# EasyEDA Pro project zkxh_robot_race_FOC_2025.eprj, board PCB1
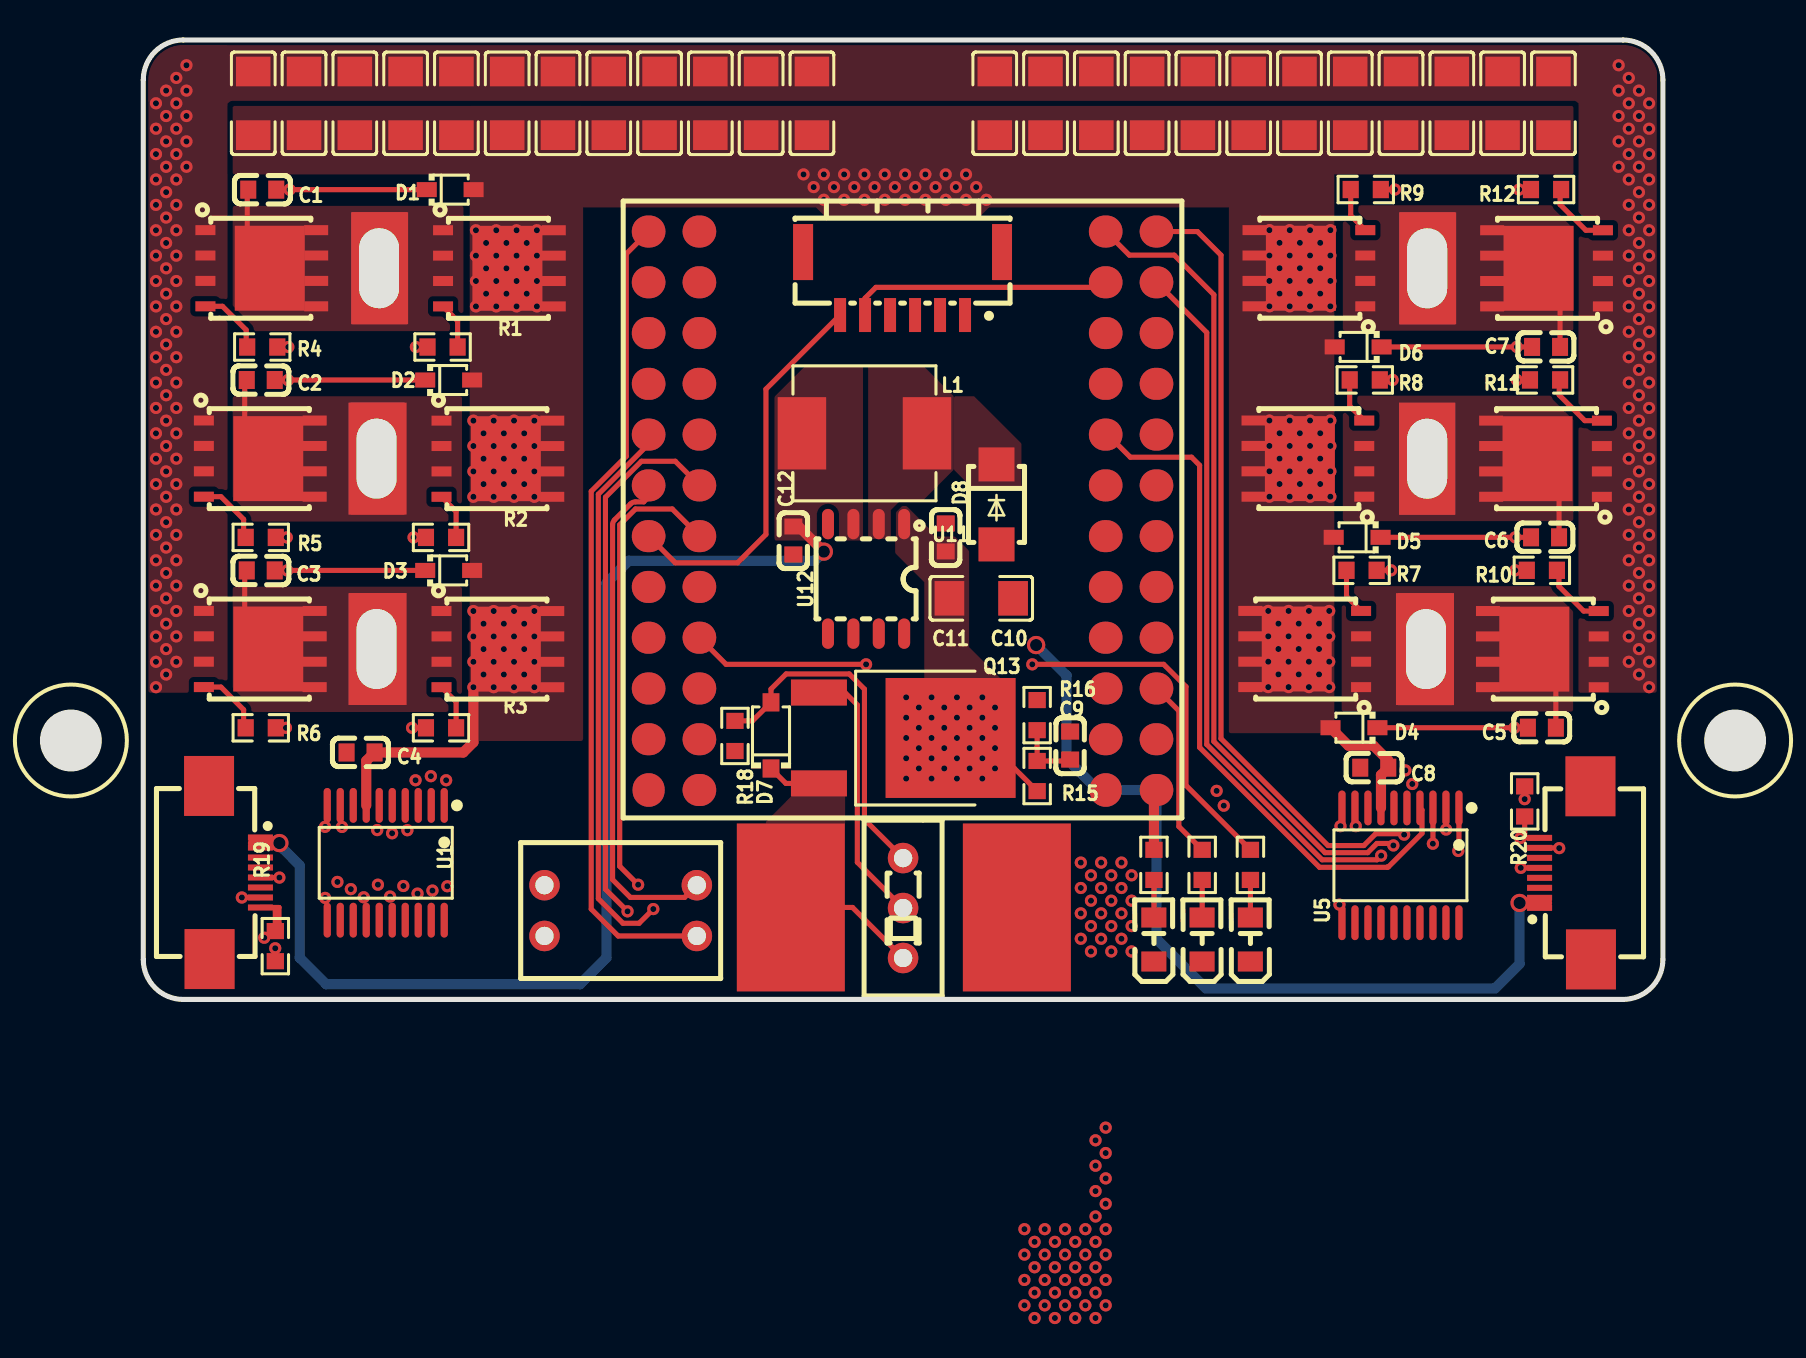
[diagram p2: board, top side]
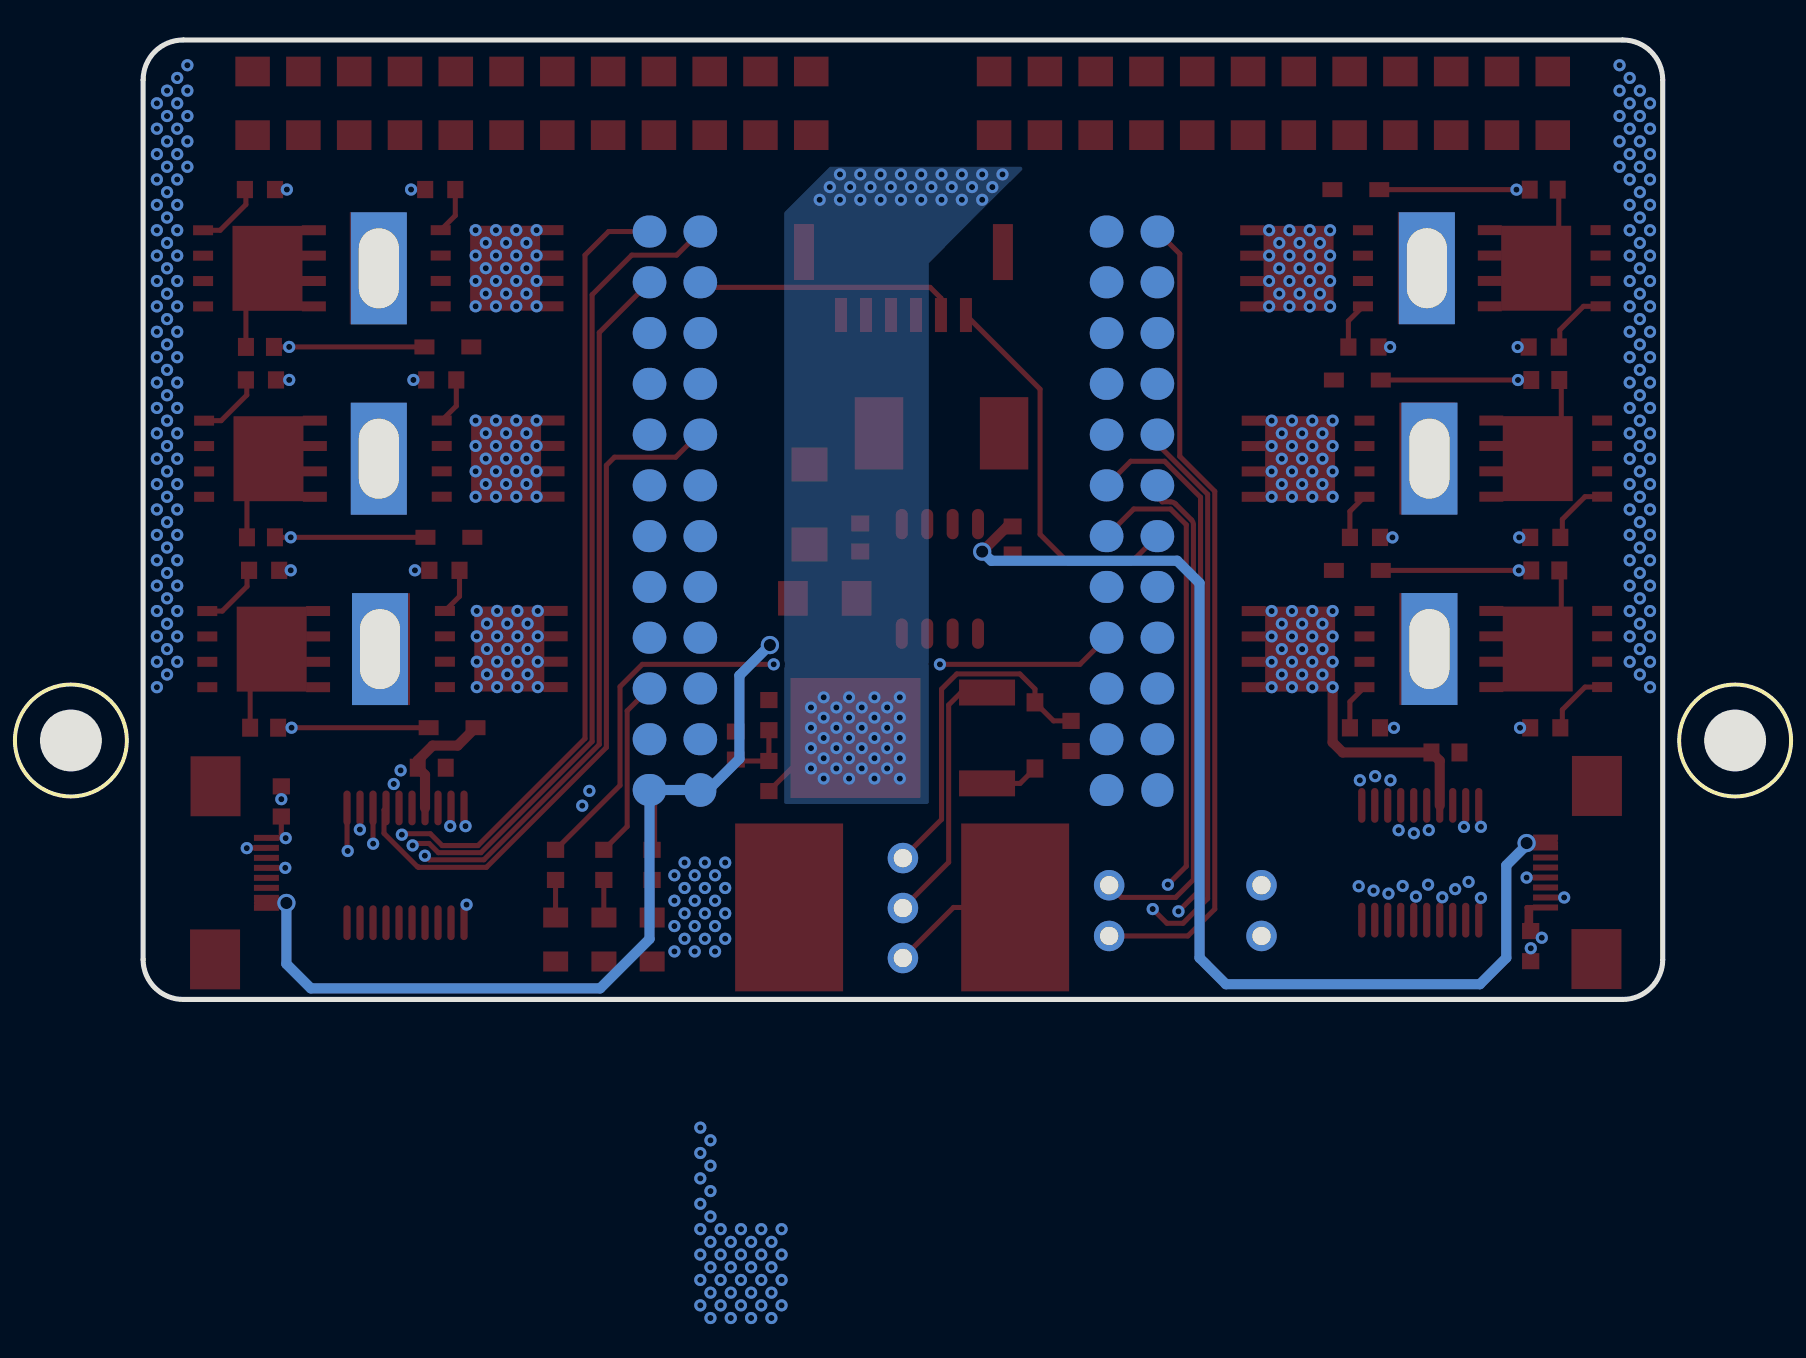
[diagram p3: board, bottom side, seen from below]

Outline 86.32 x 48 mm; copper layers: Top Layer, Inner1, Inner2, Bottom Layer. Coordinates in mm from the lower left corner of the outline.
Outline path: 5.17,46 5.17,2 arc(5.75,0.59) 7.17,0 79.17,0 arc(80.58,0.59) 81.17,2 81.17,46 arc(80.58,47.41) 79.17,48 7.17,48 arc(5.75,47.41) 5.17,46
Stack: Top Layer 0.035mm 外层铜厚1oz / Dielectric1 0.2104mm 7628 RC49% 8.6mil / Inner1 0.0152mm 内层铜厚 / Dielectric2 1.065mm 1.1mm H/HOZ Copper / Inner2 0.0152mm 内层铜厚 / Dielectric3 0.2104mm 7628 RC49% 8.6mil / Bottom Layer 0.035mm 外层铜厚1oz

## Design rules (mm)
template: 自定义配置1
spacing copperThickness1oz (default): track to track 0.102, other pairs 0.152 to 0.3
spacing copperThickness2oz: track to track 0.203, other pairs 0.152 to 0.3
track width copperThickness1oz (default): min 0.127, default 0.254, max 2.54
track width copperThickness2oz: min 0.203, default 0.508, max 2.54
differential pair differentialPair (default): width min 0.127, default 0.254, max 2.54; gap min 0.152, default 0.152
via viaSize (default): diameter min 0.5, default 0.61, max 10; hole min 0.3, default 0.305, max 6.299
net GND uses copperRegionAll
net VCC5V uses copperRegionAll, copperThickness2oz
net L_VS1 uses copperRegionAll
net L_VS2 uses copperRegionAll
net L_VS3 uses copperRegionAll
net R_VS1 uses copperRegionAll
net R_VS2 uses copperRegionAll
net R_VS3 uses copperRegionAll
net VCCBAT uses copperRegionAll, copperThickness2oz
net $1N6323 uses copperRegionAll
net $1N6897 uses copperRegionAll

## Placement (name value [footprint] x y rotation side)
C1  100nF  [C0603]  11.12 40.51 180 top
C2  100nF  [C0603]  11.04 30.99 180 top
C3  100nF  [C0603]  11.04 21.46 180 top
C4  22uF  [C0603]  16.03 12.36 0 top
C5  100nF  [C0603]  75.11 13.59 0 top
C6  100nF  [C0603]  75.27 23.12 0 top
C7  100nF  [C0603]  75.32 32.64 0 top
C8  22uF  [C0603]  66.73 11.59 0 top
C9  100nF  [C0603]  51.52 12.7 90 top
C10  10uF  [C1206]  47.08 20.07 0 top
C11  1uF  [C0603]  45.3 23.11 90 top
C12  22uF  [C0603]  37.68 22.96 90 top
C13  22uF  [C1206]  50.29 44.83 270 top
C14  22uF  [C1206]  47.75 44.83 270 top
C15  22uF  [C1206]  38.61 44.83 270 top
C16  22uF  [C1206]  36.07 44.83 270 top
C17  22uF  [C1206]  33.53 44.83 270 top
C18  22uF  [C1206]  30.99 44.83 270 top
C19  22uF  [C1206]  28.45 44.83 270 top
C20  22uF  [C1206]  25.91 44.83 270 top
C21  22uF  [C1206]  23.37 44.83 270 top
C22  22uF  [C1206]  20.83 44.83 270 top
C23  22uF  [C1206]  18.29 44.83 270 top
C24  22uF  [C1206]  15.75 44.83 270 top
C25  22uF  [C1206]  13.21 44.83 270 top
C26  22uF  [C1206]  10.67 44.83 270 top
C27  22uF  [C1206]  75.69 44.83 270 top
C28  22uF  [C1206]  73.15 44.83 270 top
C29  22uF  [C1206]  70.61 44.83 270 top
C30  22uF  [C1206]  68.07 44.83 270 top
C31  22uF  [C1206]  65.53 44.83 270 top
C32  22uF  [C1206]  62.99 44.83 270 top
C33  22uF  [C1206]  60.45 44.83 270 top
C34  22uF  [C1206]  57.91 44.83 270 top
C35  22uF  [C1206]  55.37 44.83 270 top
C36  22uF  [C1206]  52.83 44.83 270 top
D1  1N5819WS  [SOD-323_L1.8-W1.3-LS2.5-RD]  20.52 40.51 0 top
D2  1N5819WS  [SOD-323_L1.8-W1.3-LS2.5-RD]  20.44 30.99 0 top
D3  1N5819WS  [SOD-323_L1.8-W1.3-LS2.5-RD]  20.44 21.46 0 top
D4  1N5819WS  [SOD-323_L1.8-W1.3-LS2.5-RD]  65.72 13.59 180 top
D5  1N5819WS  [SOD-323_L1.8-W1.3-LS2.5-RD]  65.87 23.12 180 top
D6  1N5819WS  [SOD-323_L1.8-W1.3-LS2.5-RD]  65.93 32.64 180 top
D7  BZT52C16  [SOD-123_L2.7-W1.7-LS3.8-RD]  36.56 13.21 90 top
D8  SS34F  [SMAF_L3.5-W2.6-LS4.7-FD]  47.84 24.77 90 top
FPC1  FPC-05F-8PH20  [FPC-SMD_8P-P0.50_FPC-05F-8PH20]  9.74 6.35 270 top
FPC2  FPC-05F-8PH20  [FPC-SMD_8P-P0.50_FPC-05F-8PH20]  76.29 6.33 90 top
L1  47uH  [IND-SMD_L7.0-W6.6_FXL0630]  41.23 28.32 180 top
LED5V  -  [LED_0805]  55.71 3.05 90 top
LEDLEFT  -  [LED_0805]  58.13 3.05 90 top
LEDRIGHT  -  [LED_0805]  60.54 3.05 90 top
NOREF  -  [Pad_e162]  16.83 27.06 90 top
NOREF#2  -  [Pad_e166]  69.38 36.58 90 top
NOREF#3  -  [Pad_e165]  69.38 27.05 90 top
NOREF#4  -  [Pad_e163]  16.83 17.53 90 top
NOREF#5  -  [Pad_e164]  69.32 17.53 90 top
NOREF#6  -  [Pad_e161]  16.96 36.58 90 top
Q1  TPH1R403NL  [DSOP-8_L5.0-W5.0-P1.27-LS6.0-BL-EP]  22.93 36.58 270 top
Q2  TPH1R403NL  [DSOP-8_L5.0-W5.0-P1.27-LS6.0-BL-EP]  22.85 27.05 270 top
Q3  TPH1R403NL  [DSOP-8_L5.0-W5.0-P1.27-LS6.0-BL-EP]  22.85 17.53 270 top
Q4  TPH1R403NL  [DSOP-8_L5.0-W5.0-P1.27-LS6.0-BL-EP]  11.04 36.58 270 top
Q5  TPH1R403NL  [DSOP-8_L5.0-W5.0-P1.27-LS6.0-BL-EP]  10.97 27.06 270 top
Q6  TPH1R403NL  [DSOP-8_L5.0-W5.0-P1.27-LS6.0-BL-EP]  10.97 17.53 270 top
Q7  TPH1R403NL  [DSOP-8_L5.0-W5.0-P1.27-LS6.0-BL-EP]  63.3 17.53 90 top
Q8  TPH1R403NL  [DSOP-8_L5.0-W5.0-P1.27-LS6.0-BL-EP]  63.46 27.06 90 top
Q9  TPH1R403NL  [DSOP-8_L5.0-W5.0-P1.27-LS6.0-BL-EP]  63.51 36.58 90 top
Q10  TPH1R403NL  [DSOP-8_L5.0-W5.0-P1.27-LS6.0-BL-EP]  75.19 17.53 90 top
Q11  TPH1R403NL  [DSOP-8_L5.0-W5.0-P1.27-LS6.0-BL-EP]  75.35 27.05 90 top
Q12  TPH1R403NL  [DSOP-8_L5.0-W5.0-P1.27-LS6.0-BL-EP]  75.4 36.58 90 top
Q13  HY19P03D  [TO-252-2_L6.6-W6.1-P4.57-LS9.9-TL-CW]  42.25 13.08 0 top
R1  10Ω  [R0603]  20.13 32.64 180 top
R2  10Ω  [R0603]  20.06 23.11 180 top
R3  10Ω  [R0603]  20.06 13.59 180 top
R4  10Ω  [R0603]  11.12 32.64 0 top
R5  10Ω  [R0603]  11.04 23.11 0 top
R6  10Ω  [R0603]  11.04 13.59 0 top
R7  10Ω  [R0603]  66.1 21.47 0 top
R8  10Ω  [R0603]  66.26 30.99 0 top
R9  10Ω  [R0603]  66.31 40.52 0 top
R10  10Ω  [R0603]  75.11 21.47 180 top
R11  10Ω  [R0603]  75.27 30.99 180 top
R12  10Ω  [R0603]  75.32 40.52 180 top
R13  2.7kΩ  [R0603]  60.54 6.73 270 top
R14  2.7kΩ  [R0603]  58.13 6.73 270 top
R15  200kΩ  [R0603]  49.87 11.18 270 top
R16  20kΩ  [R0603]  49.87 14.22 270 top
R17  2.7kΩ  [R0603]  55.71 6.73 270 top
R18  10K  [R0603]  34.76 13.18 90 top
R19  4.7kΩ  [R0603]  11.77 2.67 90 top
R20  4.7kΩ  [R0603]  74.25 9.91 270 top
SW1  开关  [SW-TH_SS-12D01-GX]  43.17 4.57 90 top
TP1  -  [M3铜柱]  1.55 12.95 0 top
TP2  -  [M3铜柱]  84.78 12.95 0 top
U1  FD6288T  [TSSOP-20_L6.5-W4.4-P0.65-LS6.4-BL]  17.29 6.84 180 top
U2  -  [单焊盘]  17.01 36.58 270 top
U3  -  [单焊盘]  16.94 27.06 270 top
U4  -  [单焊盘]  16.94 17.53 270 top
U5  FD6288T  [TSSOP-20_L6.5-W4.4-P0.65-LS6.4-BL]  68.04 6.71 180 top
U6  -  [单焊盘]  69.22 17.53 90 top
U7  -  [单焊盘]  69.38 27.05 90 top
U8  -  [单焊盘]  69.43 36.58 90 top
U9  -  [单焊盘#2]  48.86 4.6 90 top
U10  -  [单焊盘#2]  37.55 4.6 90 top
U11  WeActStudio-STM32G431CB  [WEACTSTUDIO-STM32G431CB]  43.14 24.51 180 top
U12  XL1509-5.0  [SOIC-8_L4.9-W3.9-P1.27-LS6.0-TR]  41.32 21.04 0 top
U13  2位DIP拨码开关  [SW-TH_4P-L9.9-W6.8-P7.62-BL]  29.04 4.44 270 top
U14  WAFER-GH1.25-6PWB  [CONN-SMD_6P-P1.25_XUNPU_WAFER-GH1.25-6PWB]  43.14 35.81 180 top

## Footprints (pads in the part's own frame, mm; a bottom-side part is the same pattern mirrored in y, then rotated)
C0603
  rect 0.8x0.9 smd: 1(-0.7,0) 2(0.7,0)
C1206
  rect 1.485x1.728 smd: 1(-1.593,0) 2(1.593,0)
CONN-SMD_6P-P1.25_XUNPU_WAFER-GH1.25-6PWB
  rect 0.6x1.7 smd: 1(-3.125,1.575) 2(-1.875,1.575) 3(-0.625,1.575) 4(0.625,1.575) 5(1.875,1.575) 6(3.125,1.575)
  rect 1x2.8 smd: 7(4.975,-1.575) 8(-4.975,-1.575)
DSOP-8_L5.0-W5.0-P1.27-LS6.0-BL-EP
  rect 0.5x1 smd: 1(-1.905,-2.77) 2(-0.635,-2.77) 3(0.634,-2.77) 4(1.905,-2.77)
  rect 0.5x1.2 smd: 5(1.905,2.77) 6(0.635,2.77) 7(-0.634,2.77) 8(-1.905,2.77)
  custom 4.25x3.5 smd: 9(0,0.45)
FPC-SMD_8P-P0.50_FPC-05F-8PH20
  rect 0.3x1.25 smd: 1(-1.75,1.288) 2(-1.25,1.288) 3(-0.75,1.288) 4(-0.25,1.288) 5(0.25,1.288) 6(0.75,1.288) 7(1.25,1.288) 8(1.75,1.288)
  rect 3x2.5 smd: 9(4.33,-1.258) 10(-4.33,-1.282)
IND-SMD_L7.0-W6.6_FXL0630
  rect 2.424x3.62 smd: 1(3.128,0) 2(-3.128,0)
LED_0805
  rect 1x1.25 smd: 1(-1.15,0.005) 2(1.05,0.005)
Pad_e161
  rect 5.6x2.8 hole 4x2: 1(0,0)
Pad_e162
  rect 5.6x2.8 hole 4x2: 1(0,0)
Pad_e163
  rect 5.6x2.8 hole 4x2: 1(0,0)
Pad_e164
  rect 5.6x2.8 hole 4x2: 1(0,0)
Pad_e165
  rect 5.6x2.8 hole 4x2: 1(0,0)
Pad_e166
  rect 5.6x2.8 hole 4x2: 1(0,0)
R0603
  rect 0.806x0.864 smd: 1(-0.753,0) 2(0.753,0)
SMAF_L3.5-W2.6-LS4.7-FD
  rect 1.7x1.8 smd: 1(-2,0) 2(2,0)
SOD-123_L2.7-W1.7-LS3.8-RD
  rect 0.91x0.84 smd: 1(-1.655,0) 2(1.655,0)
SOD-323_L1.8-W1.3-LS2.5-RD
  rect 1x0.75 smd: 1(-1.173,0) 2(1.173,0)
SOIC-8_L4.9-W3.9-P1.27-LS6.0-TR
  oval 0.6x1.52 smd: 1(1.905,2.74) 2(0.635,2.74) 3(-0.635,2.74) 4(-1.905,2.74) 5(-1.905,-2.74) 6(-0.635,-2.74) 7(0.635,-2.74) 8(1.905,-2.74)
SW-TH_4P-L9.9-W6.8-P7.62-BL
  round 1.524 hole 0.914: 1(-1.27,-3.81) 2(1.27,-3.81) 3(1.27,3.81) 4(-1.27,3.81)
SW-TH_SS-12D01-GX
  round 1.524 hole 0.914: 1(-2.5,0) 2(0,0) 3(2.5,0)
TO-252-2_L6.6-W6.1-P4.57-LS9.9-TL-CW
  rect 2.8x1.3 smd: 1(-3.292,2.273) 3(-3.292,-2.273)
  rect 6.5x6 smd: 2(3.292,0)
TSSOP-20_L6.5-W4.4-P0.65-LS6.4-BL
  oval 0.364x1.742 smd: 1(-2.925,-2.871) 2(-2.275,-2.871) 3(-1.625,-2.871) 4(-0.975,-2.871) 5(-0.325,-2.871) 6(0.325,-2.871) 7(0.975,-2.871) 8(1.625,-2.871) 9(2.275,-2.871) 10(2.925,-2.871) 11(2.925,2.871) 12(2.275,2.871) 13(1.625,2.871) 14(0.975,2.871) 15(0.325,2.871) 16(-0.325,2.871) 17(-0.975,2.871) 18(-1.625,2.871) 19(-2.275,2.871) 20(-2.925,2.871)
WEACTSTUDIO-STM32G431CB
  custom 1.68x1.6 hole 1: 1(-12.7,14.034)
  custom 1.6x1.68 hole 1x1.005: 2(-10.16,14.034) 26(12.7,14.034)
  custom 1.68x1.6 hole 1.005x1: 3(-12.7,11.493) 4(-10.16,11.493) 5(-12.7,8.954) 6(-10.16,8.954) 7(-12.7,6.413) 8(-10.16,6.413) 9(-12.7,3.873) 10(-10.16,3.873) 11(-12.7,1.333) 12(-10.16,1.333) 13(-12.7,-1.206) 14(-10.16,-1.206) 15(-12.7,-3.747) 16(-10.16,-3.747) 17(-12.7,-6.287) 18(-10.16,-6.287) 19(-12.7,-8.826) 20(-10.16,-8.826) 21(-12.7,-11.367) 22(-10.16,-11.367) 23(-12.7,-13.906) 24(-10.16,-13.906) 25(10.16,14.034) 27(10.16,11.493) 28(12.7,11.493) 29(10.16,8.954) 30(12.7,8.954) 31(10.16,6.413) 32(12.7,6.413) 33(10.16,3.873) 34(12.7,3.873) 35(10.16,1.333) 36(12.7,1.333) 37(10.16,-1.206) 38(12.7,-1.206) 39(10.16,-3.747) 40(12.7,-3.747) 41(10.16,-6.287) 42(12.7,-6.287) 43(10.16,-8.826) 44(12.7,-8.826) 45(10.16,-11.367) 46(12.7,-11.367) 47(10.16,-13.906) 48(12.7,-13.906)
单焊盘
  rect 5.598x2.8 smd: 1(0,0)
单焊盘#2
  rect 8.4x5.4 smd: 1(0,0)

## Nets
As in the schematic, except:
L_VS1: C1.2 NOREF#6.1 Q1.1 Q1.2 Q1.3 Q4.5 Q4.6 Q4.7 Q4.8 Q4.9 U1.18 U2.1
L_VS2: C2.2 NOREF.1 Q2.1 Q2.2 Q2.3 Q5.5 Q5.6 Q5.7 Q5.8 Q5.9 U1.15 U3.1
L_VS3: C3.2 NOREF#4.1 Q3.1 Q3.2 Q3.3 Q6.5 Q6.6 Q6.7 Q6.8 Q6.9 U1.12 U4.1
R_VS1: C5.2 NOREF#5.1 Q7.1 Q7.2 Q7.3 Q10.5 Q10.6 Q10.7 Q10.8 Q10.9 U5.18 U6.1
R_VS2: C6.2 NOREF#3.1 Q8.1 Q8.2 Q8.3 Q11.5 Q11.6 Q11.7 Q11.8 Q11.9 U5.15 U7.1
R_VS3: C7.2 NOREF#2.1 Q9.1 Q9.2 Q9.3 Q12.5 Q12.6 Q12.7 Q12.8 Q12.9 U5.12 U8.1

Pads without a net: FPC1 4 9 10; FPC2 4 9 10; U11 9 13 14 25 26 32 39 41 42 43 45 46 47; U12 4; U14 7 8

## Via types
v1: diameter 0.61, hole 0.305, Top Layer to Bottom Layer, 497 vias
v2: diameter 0.914, hole 0.61, Top Layer to Bottom Layer, 4 vias

## Routing (per net, layer and track width the routed paths; a pad name or vN(x,y) marks a point on that pad's centre or on a via; arc(x,y) is an arc through that point)
GND:
  vias: v1(5.8,44.83) v1(5.8,43.56) v1(5.8,42.29) v1(5.8,41.02) v1(5.8,39.75) v1(5.8,38.48) v1(5.8,37.21) v1(5.8,35.94) v1(5.8,34.67) v1(5.8,33.4) v1(5.8,32.13) v1(5.8,30.86) v1(5.8,29.59) v1(5.8,28.32) v1(5.8,27.05) v1(5.8,25.78) v1(5.8,24.51) v1(5.8,23.24) v1(5.8,21.97) v1(5.8,20.7) v1(5.8,19.43) v1(5.8,18.16) v1(5.8,16.89) v1(5.8,15.62) v1(6.31,45.47) v1(6.31,44.2) v1(6.31,42.93) v1(6.31,41.66) v1(6.31,40.39) v1(6.31,39.12) v1(6.31,37.85) v1(6.31,36.58) v1(6.31,35.31) v1(6.31,34.04) v1(6.31,32.77) v1(6.31,31.5) v1(6.31,30.23) v1(6.31,28.96) v1(6.31,27.69) v1(6.31,26.42) v1(6.31,25.15) v1(6.31,23.88) v1(6.31,22.61) v1(6.31,21.34) v1(6.31,20.07) v1(6.31,18.8) v1(6.31,17.53) v1(6.31,16.26) v1(6.82,46.1) v1(6.82,44.83) v1(6.82,43.56) v1(6.82,42.29) v1(6.82,41.02) v1(6.82,39.75) v1(6.82,38.48) v1(6.82,37.21) v1(6.82,35.94) v1(6.82,34.67) v1(6.82,33.4) v1(6.82,32.13) v1(6.82,30.86) v1(6.82,29.59) v1(6.82,28.32) v1(6.82,27.05) v1(6.82,25.78) v1(6.82,24.51) v1(6.82,23.24) v1(6.82,21.97) v1(6.82,20.7) v1(6.82,19.43) v1(6.82,18.16) v1(6.82,16.89) v1(7.33,46.74) v1(7.33,45.47) v1(7.33,44.2) v1(7.33,42.93) v1(7.33,41.66) v1(52.05,6.85) v1(52.05,5.58) v1(52.05,4.31) v1(52.05,3.04) v1(52.56,6.21) v1(52.56,4.94) v1(52.56,3.67) v1(52.56,2.4) v1(53.07,6.85) v1(53.07,5.58) v1(53.07,4.31) v1(53.07,3.04) v1(53.58,6.21) v1(53.58,4.94) v1(53.58,3.67) v1(53.58,2.4) v1(54.09,6.85) v1(54.09,5.58) v1(54.09,4.31) v1(54.09,3.04) v1(54.59,6.21) v1(54.59,4.94) v1(54.59,3.67) v1(54.59,2.4) v1(78.95,46.74) v1(78.95,45.47) v1(78.95,44.2) v1(78.95,42.93) v1(78.95,41.66) v1(79.46,46.1) v1(79.46,44.83) v1(79.46,43.56) v1(79.46,42.29) v1(79.46,41.02) v1(79.46,39.75) v1(79.46,38.48) v1(79.46,37.21) v1(79.46,35.94) v1(79.46,34.67) v1(79.46,33.4) v1(79.46,32.13) v1(79.46,30.86) v1(79.46,29.59) v1(79.46,28.32) v1(79.46,27.05) v1(79.46,25.78) v1(79.46,24.51) v1(79.46,23.24) v1(79.46,21.97) v1(79.46,20.7) v1(79.46,19.43) v1(79.46,18.16) v1(79.46,16.89) v1(79.97,45.47) v1(79.97,44.2) v1(79.97,42.93) v1(79.97,41.66) v1(79.97,40.39) v1(79.97,39.12) v1(79.97,37.85) v1(79.97,36.58) v1(79.97,35.31) v1(79.97,34.04) v1(79.97,32.77) v1(79.97,31.5) v1(79.97,30.23) v1(79.97,28.96) v1(79.97,27.69) v1(79.97,26.42) v1(79.97,25.15) v1(79.97,23.88) v1(79.97,22.61) v1(79.97,21.34) v1(79.97,20.07) v1(79.97,18.8) v1(79.97,17.53) v1(79.97,16.26) v1(80.48,44.83) v1(80.48,43.56) v1(80.48,42.29) v1(80.48,41.02) v1(80.48,39.75) v1(80.48,38.48) v1(80.48,37.21) v1(80.48,35.94) v1(80.48,34.67) v1(80.48,33.4) v1(80.48,32.13) v1(80.48,30.86) v1(80.48,29.59) v1(80.48,28.32) v1(80.48,27.05) v1(80.48,25.78) v1(80.48,24.51) v1(80.48,23.24) v1(80.48,21.97) v1(80.48,20.7) v1(80.48,19.43) v1(80.48,18.16) v1(80.48,16.89) v1(80.48,15.62)
VCC5V: length 114.9
  Top Layer w0.508: v2(74,4.83) 75.37,4.83 ; v2(11.97,7.82) 10.65,7.82 ; R17.1 55.71,10.35 U11.1 ; C12.2 37.94,23.66 v2(39.2,22.4)
  Inner2 w0.508: v2(49.82,17.73) 46.72,17.73 42.05,22.4 v2(39.2,22.4)
  Bottom Layer w0.508: v2(49.82,17.73) 51.34,16.2 51.34,12.04 52.91,10.48 U11.2 U11.1 55.84,3.02 58.31,0.55 72.78,0.55 74,1.78 v2(74,4.83) ; v2(39.2,22.4) 38.75,21.95 29.45,21.95 28.33,20.83 28.33,2.08 27.01,0.76 14.31,0.76 12.99,2.08 12.99,6.71 11.97,7.72 v2(11.97,7.82)
VCCBAT: length 19.4
  Top Layer w0.254: v1(47.76,11.56) 48.74,11.56 R15.2
  Top Layer w0.508: v1(21.68,15.62) 21.68,12.86 21.17,12.36 C4.2 16.32,11.94 U1.7 ; D4.2 65.44,12.7 66.69,12.7 67.43,11.95 C8.2 67.07,11.23 U5.7
  vias: v1(21.68,28.96) v1(21.68,27.69) v1(21.68,26.42) v1(21.68,25.15) v1(21.68,19.43) v1(21.68,18.16) v1(21.68,16.89) v1(21.8,38.48) v1(21.8,37.21) v1(21.8,35.94) v1(21.8,34.67) v1(22.18,28.32) v1(22.18,27.05) v1(22.18,25.78) v1(22.18,18.8) v1(22.18,17.53) v1(22.18,16.26) v1(22.31,37.85) v1(22.31,36.58) v1(22.31,35.31) v1(22.69,28.96) v1(22.69,27.69) v1(22.69,26.42) v1(22.69,25.15) v1(22.69,19.43) v1(22.69,18.16) v1(22.69,16.89) v1(22.69,15.62) v1(22.82,38.48) v1(22.82,37.21) v1(22.82,35.94) v1(22.82,34.67) v1(23.2,28.32) v1(23.2,27.05) v1(23.2,25.78) v1(23.2,18.8) v1(23.2,17.53) v1(23.2,16.26) v1(23.33,37.85) v1(23.33,36.58) v1(23.33,35.31) v1(23.71,28.96) v1(23.71,27.69) v1(23.71,26.42) v1(23.71,25.15) v1(23.71,19.43) v1(23.71,18.16) v1(23.71,16.89) v1(23.71,15.62) v1(23.84,38.48) v1(23.84,37.21) v1(23.84,35.94) v1(23.84,34.67) v1(24.22,28.32) v1(24.22,27.05) v1(24.22,25.78) v1(24.22,18.8) v1(24.22,17.53) v1(24.22,16.26) v1(24.34,37.85) v1(24.34,36.58) v1(24.34,35.31) v1(24.72,28.96) v1(24.72,27.69) v1(24.72,26.42) v1(24.72,25.15) v1(24.72,19.43) v1(24.72,18.16) v1(24.72,16.89) v1(24.72,15.62) v1(24.85,38.48) v1(24.85,37.21) v1(24.85,35.94) v1(24.85,34.67) v1(38.19,41.28) v1(38.69,40.64) v1(39.2,41.28) v1(39.2,40) v1(39.71,40.64) v1(40.22,41.28) v1(40.22,40) v1(40.73,40.64) v1(41.23,41.28) v1(41.23,40) v1(41.74,40.64) v1(42.25,41.28) v1(42.25,40) v1(42.76,40.64) v1(43.27,41.28) v1(43.27,40) v1(43.32,15.11) v1(43.32,14.1) v1(43.32,13.08) v1(43.32,12.06) v1(43.32,11.05) v1(43.77,40.64) v1(43.95,14.61) v1(43.95,13.59) v1(43.95,12.57) v1(43.95,11.56) v1(44.28,41.28) v1(44.28,40) v1(44.59,15.11) v1(44.59,14.1) v1(44.59,13.08) v1(44.59,12.06) v1(44.59,11.05) v1(44.79,40.64) v1(45.3,41.28) v1(45.3,40) v1(45.22,14.61) v1(45.22,13.59) v1(45.22,12.57) v1(45.22,11.56) v1(45.81,40.64) v1(45.86,15.11) v1(45.86,14.1) v1(45.86,13.08) v1(45.86,12.06) v1(45.86,11.05) v1(46.31,41.28) v1(46.31,40) v1(46.49,14.61) v1(46.49,13.59) v1(46.49,12.57) v1(46.49,11.56) v1(46.82,40.64) v1(47.13,15.11) v1(47.13,14.1) v1(47.13,13.08) v1(47.13,12.06) v1(47.13,11.05) v1(47.33,40) v1(47.76,14.61) v1(47.76,13.59) v1(47.76,12.57) v1(61.49,38.49) v1(61.49,37.22) v1(61.49,35.95) v1(61.49,34.68) v1(61.49,28.96) v1(61.49,27.69) v1(61.49,26.42) v1(61.49,25.15) v1(61.43,19.44) v1(61.43,18.17) v1(61.43,16.9) v1(61.43,15.63) v1(62,37.85) v1(62,36.58) v1(62,35.31) v1(62,28.33) v1(62,27.06) v1(62,25.79) v1(61.94,18.8) v1(61.94,17.53) v1(61.94,16.26) v1(62.5,38.49) v1(62.5,37.22) v1(62.5,35.95) v1(62.5,34.68) v1(62.5,28.96) v1(62.5,27.69) v1(62.5,26.42) v1(62.5,25.15) v1(62.45,19.44) v1(62.45,18.17) v1(62.45,16.9) v1(62.45,15.63) v1(63.01,37.85) v1(63.01,36.58) v1(63.01,35.31) v1(63.01,28.33) v1(63.01,27.06) v1(63.01,25.79) v1(62.95,18.8) v1(62.95,17.53) v1(62.95,16.26) v1(63.46,19.44) v1(63.46,18.17) v1(63.46,16.9) v1(63.46,15.63) v1(63.52,38.49) v1(63.52,37.22) v1(63.52,35.95) v1(63.52,34.68) v1(63.52,28.96) v1(63.52,27.69) v1(63.52,26.42) v1(63.52,25.15) v1(63.97,18.8) v1(63.97,17.53) v1(63.97,16.26) v1(64.03,37.85) v1(64.03,36.58) v1(64.03,35.31) v1(64.03,28.33) v1(64.03,27.06) v1(64.03,25.79) v1(64.48,19.44) v1(64.48,18.17) v1(64.48,16.9) v1(64.48,15.63) v1(64.54,38.49) v1(64.54,37.22) v1(64.54,35.95) v1(64.54,34.68) v1(64.54,28.96) v1(64.54,27.69) v1(64.54,26.42) v1(64.54,25.15)
(no net):
  vias: v1(49.24,-11.49) v1(49.24,-12.76) v1(49.24,-14.03) v1(49.24,-15.3) v1(49.74,-12.13) v1(49.74,-13.4) v1(49.74,-14.67) v1(49.74,-15.94) v1(50.25,-11.49) v1(50.25,-12.76) v1(50.25,-14.03) v1(50.25,-15.3) v1(50.76,-12.13) v1(50.76,-13.4) v1(50.76,-14.67) v1(50.76,-15.94) v1(51.27,-11.49) v1(51.27,-12.76) v1(51.27,-14.03) v1(51.27,-15.3) v1(51.78,-12.13) v1(51.78,-13.4) v1(51.78,-14.67) v1(51.78,-15.94) v1(52.28,-11.49) v1(52.28,-12.76) v1(52.28,-14.03) v1(52.28,-15.3) v1(52.79,-7.05) v1(52.79,-8.32) v1(52.79,-9.59) v1(52.79,-10.86) v1(52.79,-12.13) v1(52.79,-13.4) v1(52.79,-14.67) v1(52.79,-15.94) v1(53.3,-6.41) v1(53.3,-7.68) v1(53.3,-8.95) v1(53.3,-10.22) v1(53.3,-11.49) v1(53.3,-12.76) v1(53.3,-14.03) v1(53.3,-15.3)
ADC1_IN1: length 3.2
  Top Layer w0.254: R16.2 R15.1 51.45,11.93 C9.1
L_AH: length 0.6
  Top Layer w0.254: R1.2 v1(18.8,32.64)
  vias: v1(19.63,5.45)
L_AL: length 0.6
  Top Layer w0.254: R4.2 v1(12.42,32.64)
  vias: v1(14.26,5.08)
L_BH: length 0.6
  Top Layer w0.254: R2.2 v1(18.68,23.11)
  vias: v1(17.51,5.15)
L_BL: length 0.5
  Top Layer w0.254: R5.2 v1(12.34,23.11)
  vias: v1(14.26,8.64)
L_CH: length 0.7
  Top Layer w0.254: R3.2 v1(18.61,13.59)
  vias: v1(15.55,5.52)
L_CL: length 0.5
  Top Layer w0.254: R6.2 v1(12.3,13.59)
  vias: v1(15.11,8.63)
L_PWMAH: length 8.3
  Inner2 w0.254: U11.10 53.3,20.83 48.73,25.4 47.09,25.4
  vias: v1(20.31,10.97)
L_PWMAL: length 11.5
  Inner2 w0.254: U11.6 51.33,17.53 51.33,21.28 48.29,24.33 47.6,24.33
  vias: v1(18.38,8.47)
L_PWMBH: length 11.2
  Inner2 w0.254: U11.11 54.75,22.08 52.55,22.08 48.87,25.75 46.58,25.75
  vias: v1(19.55,11.17)
L_PWMBL: length 14
  Inner2 w0.254: U11.7 54.62,16.88 52.75,16.88 51.69,17.94 51.69,21.43 48.43,24.69 47.6,24.69
  vias: v1(17.61,8.31)
L_PWMCH: length 8
  Inner2 w0.254: U11.12 53.3,23.65 50.84,26.11 46.78,26.11
  vias: v1(18.78,10.97)
L_PWMCL: length 10.1
  Inner2 w0.254: U11.8 52.04,19.35 52.04,21.58 48.58,25.04 47.39,25.04
  vias: v1(16.87,8.47)
L_VB1: length 7.5
  Top Layer w0.254: 19.29,40.51 v1(12.48,40.51) 11.77,40.51
  vias: v1(20.37,5.66)
L_VB2: length 7.5
  Top Layer w0.254: 19.16,30.99 v1(12.41,30.99) 11.64,30.99
  vias: v1(18.17,5.68)
L_VB3: length 7.5
  Top Layer w0.254: 11.64,21.46 v1(12.36,21.46) 19.16,21.46
  vias: v1(16.19,5.11)
L_VS1: length 4.4
  Top Layer w0.254: 11.44,36.58 10.37,37.66 10.37,40.51
  vias: v1(18.88,5.29)
L_VS2: length 4.4
  Top Layer w0.254: 11.32,27.06 10.24,28.13 10.24,30.99
  vias: v1(16.9,5.74)
L_VS3: length 4.4
  Top Layer w0.254: 10.24,21.46 10.24,18.61 11.32,17.53
  vias: v1(14.88,5.88)
LEFT_LED: length 9
  Top Layer w0.254: R14.1 56.96,8.65 56.96,14.44 U11.5
R_AH: length 0.7
  Top Layer w0.254: R7.2 v1(67.57,21.47)
R_AL: length 0.6
  Top Layer w0.254: R10.2 v1(73.78,21.47)
  vias: v1(64.99,4.74)
R_BH: length 0.6
  Top Layer w0.254: R8.2 v1(67.65,30.99)
R_BL: length 0.7
  Top Layer w0.254: R11.2 v1(73.86,30.99)
  vias: v1(65.04,8.67)
R_CH: length 0.7
  Top Layer w0.254: R9.2 v1(67.77,40.52)
R_CL: length 0.6
  Top Layer w0.254: R12.2 v1(73.98,40.52)
  vias: v1(65.81,8.67)
R_PWMAH: length 41.6
  Top Layer w0.254: U5.1 70.97,7.46 v1(70.93,7.43) ; v1(67.08,7.19) 66.87,6.99 64.12,6.99 58.35,12.76 58.35,33.36 U11.21
  Inner2 w0.254: v1(67.08,7.19) 67.23,7.04 70.54,7.04 v1(70.93,7.43)
R_PWMAL: length 35.1
  Top Layer w0.254: U11.16 53.4,28.26 54.53,27.13 57.59,27.13 58,26.72 58,12.61 64,6.61 67.37,6.61 67.4,6.63 67.44,6.63 69.12,8.31 69.12,9.48 U5.4
R_PWMBH: length 42.8
  Top Layer w0.254: v1(68.23,8.24) 68.18,8.29 66.8,8.29 66.21,7.7 64.42,7.7 59.07,13.05 59.07,37.24 57.88,38.42 U11.23 ; U5.2 70.33,9.57 v1(70.33,8.5)
  Inner2 w0.254: v1(70.33,8.5) 70.32,8.5 69.54,8.5 69.29,8.24 v1(68.23,8.24)
R_PWMBL: length 42.6
  Inner2 w0.254: 32.98,20.64 32.98,21.11 38.34,26.47 50.98,26.47 52.82,24.63 56.93,24.63 59.08,22.49 59.08,10.66 v1(58.85,10.43)
  vias: v1(68.63,10.78)
R_PWMCH: length 44.4
  Top Layer w0.254: U5.3 69.67,7.8 v1(69.66,7.79) ; U11.24 54.48,37.24 56.73,37.24 58.71,35.25 58.71,12.9 64.27,7.34 66.4,7.34 66.86,7.8 67.59,7.8 v1(67.69,7.7)
  Inner2 w0.254: v1(69.66,7.79) 69.53,7.66 67.73,7.66 v1(67.69,7.7)
R_PWMCL: length 47.4
  Inner2 w0.254: v1(59.2,9.69) 59.43,9.92 59.43,24.49 57.1,26.82 38.19,26.82 33.4,22.03 32.3,22.03 30.9,20.64 30.44,20.64
  vias: v1(68.29,11.46)
R_VB1: length 7.5
  Top Layer w0.254: D4.1 v1(73.74,13.59) C5.1
R_VB2: length 7.5
  Top Layer w0.254: D5.1 v1(73.78,23.12) C6.1
R_VB3: length 7.5
  Top Layer w0.254: 74.57,32.64 v1(73.86,32.64) 67.05,32.64
R_VS1: length 4.4
  Top Layer w0.254: C5.2 75.81,16.45 Q10.9
R_VS2: length 4.4
  Top Layer w0.254: Q11.9 75.97,25.97 C6.2
R_VS3: length 4.4
  Top Layer w0.254: C7.2 76.02,35.5 Q12.9
RIGHT_LED: length 34.8
  Top Layer w0.254: v1(49.63,16.76) 56.2,16.76 57.31,15.65 57.31,10.71 R13.1 ; 32.98,18.1 34.31,16.76 v1(41.32,16.76)
  Inner1 w0.254: v1(49.63,16.76) v1(41.32,16.76)
SPI1_MISO: length 97.4
  Top Layer w0.254: 11.77,3.64 11.95,3.82 11.95,4.6 ; 11.77,3.64 R19.2 ; 11.77,3.64 11.77,4.42 11.95,4.6 ; 11.77,3.64 v1(11.21,3.09) ; 11.95,4.6 FPC1.8
  Inner2 w0.254: U11.19 54.6,34.58 52.49,34.58 51.02,33.1 51.02,28.46 52.3,27.18 57.24,27.18 59.79,24.63 59.79,4.08 56.13,0.43 13.05,0.43 10.96,2.52 10.96,2.83 v1(11.21,3.09)
SPI1_MOSI: length 48.9
  Top Layer w0.254: 32.98,23.18 31.62,24.54 29.78,24.54 28.99,23.75 28.99,6.66 v1(29.92,5.74) ; R19.1 11.77,2.55 v1(11.76,2.56)
  Inner2 w0.254: v1(11.76,2.56) 13.54,0.78 28.49,0.78 29.2,1.49 29.2,3.15 29.8,3.75 30.73,3.75 31.26,4.28 31.26,4.9 30.41,5.74 v1(29.92,5.74)
SPI1_NSS: length 54.2
  Top Layer w0.254: FPC1.5 11.97,6.1 v1(11.97,6.1) ; v1(30.67,4.52) 29.96,3.81 29.16,3.81 27.93,5.04 27.93,25.27 30.44,27.79 30.44,28.26
  Inner2 w0.254: v1(30.67,4.52) 30.21,4.52 29.74,4.99 29.05,4.99 28.48,4.42 28.48,2.15 27.83,1.5 14.28,1.5 11.39,4.38 11.39,5.51 v1(11.97,6.1)
SPI1_SCK: length 51.6
  Top Layer w0.254: FPC1.7 v1(10.1,5.1) ; v1(29.39,4.41) 28.28,5.51 28.28,25.12 30.08,26.92 31.77,26.92 32.98,25.72
  Inner2 w0.254: v1(10.1,5.1) 10.1,5.06 14.01,1.14 28.18,1.14 28.84,1.79 28.84,3.86 v1(29.39,4.41)
SPI3_MISO: length 2.1
  Top Layer w0.254: 74.05,8.08 74.25,8.29 R20.2 ; 74.05,8.08 v1(74.04,8.07) ; 74.05,8.08 FPC2.8
SPI3_MOSI: length 0.6
  Top Layer w0.254: v1(74.25,10.02) R20.1
SPI3_NSS: length 4.9
  Top Layer w0.254: FPC2.5 v1(74.06,6.58)
  Inner1 w0.254: U11.15 57.85,26.25 57.85,25.09
SPI3_SCK: length 9.9
  Top Layer w0.254: v1(75.98,7.57) 75.97,7.58 FPC2.7
  Inner1 w0.254: U11.18 54.38,29.72 56.47,29.72 58.2,27.99 58.2,25.09
TIM1_BRAKE: length 40.9
  Top Layer w0.254: U13.3 28.92,3.17 27.57,4.52 27.57,25.42 29.32,27.17 29.32,37.3 30.44,38.42
TIM8_BRAKE: length 25.6
  Top Layer w0.254: 30.44,25.72 30.39,25.67 30.39,25.09 30.19,24.89 29.78,24.89 arc(29.65,24.87) 29.53,24.79 28.74,24 arc(28.66,23.88) 28.64,23.75 28.64,5.99 29.52,5.11 32.24,5.11 32.85,5.72
USART1_RX: length 13.4
  Top Layer w0.254: 41.26,34.24 41.26,35.08 41.81,35.62 53.3,35.62 U11.22
USART1_TX: length 19.5
  Top Layer w0.254: 30.44,23.18 31.77,21.84 34.88,21.84 36.31,23.27 36.31,30.53 40.01,34.24
$1N4251: length 2.3
  Top Layer w0.254: Q1.4 20.89,33.94 20.89,32.64
$1N4259: length 3.5
  Top Layer w0.254: 10.19,23.11 10.19,24.02 9.05,25.15 8.1,25.15
$1N4264: length 3.5
  Top Layer w0.254: 8.1,15.63 9.05,15.63 10.19,14.49 10.19,13.59
$1N4273: length 2.3
  Top Layer w0.254: Q2.4 20.81,24.42 R2.1
$1N4274: length 2.3
  Top Layer w0.254: R3.1 20.81,14.89 Q3.4
$1N4289: length 3.4
  Top Layer w0.254: 10.31,32.64 10.31,33.49 9.13,34.68 8.22,34.68
$1N4330: length 2.3
  Top Layer w0.254: R8.1 65.5,29.69 Q8.4
$1N4338: length 3.4
  Top Layer w0.254: 76.03,40.52 76.03,39.77 77.31,38.48 78.12,38.48
$1N4343: length 3.4
  Top Layer w0.254: 78.06,19.43 77.2,19.43 75.97,20.67 75.97,21.47
$1N4352: length 2.3
  Top Layer w0.254: 65.55,40.52 65.55,39.21 Q9.4
$1N4353: length 2.3
  Top Layer w0.254: Q7.4 65.34,20.16 R7.1
$1N4368: length 3.4
  Top Layer w0.254: R11.1 75.98,30.95 75.98,30.24 77.26,28.96 Q11.4
$1N6318: length 1.9
  Top Layer w0.254: R17.2 55.71,4.1 LED5V.2
$1N6425: length 1.9
  Top Layer w0.254: R14.2 58.13,4.1 LEDLEFT.2
$1N6508: length 1.9
  Top Layer w0.254: R13.2 60.54,4.1 LEDRIGHT.2
$1N6790: length 17.4
  Top Layer w0.254: SW1.3 41.23,9 41.23,15.52 40.47,16.28 37.32,16.28 36.56,15.53 D7.2 35.63,13.94 R18.2
$1N6792: length 13.3
  Top Layer w0.254: SW1.2 40.88,6.86 40.88,14.73 40.26,15.35 Q13.1
$1N6897: length 9.4
  Top Layer w0.254: Q13.3 37.31,10.81 D7.1 ; SW1.1 40.64,4.6 U10.1

## Copper pours and planes (outline as drawn; the poured copper is in the pictures)
GND on Top Layer: 5.37,47.75 9.38,47.75 9.38,15.34 5.37,15.34
GND on Top Layer: 76.95,47.75 80.86,47.75 80.86,15.34 76.95,15.34
GND on Top Layer: 5.37,47.75 80.87,47.75 80.87,44.83 5.37,44.83
VCC5V on Top Layer: 36.73,22.95 41.16,22.95 41.16,31.7 38.28,31.7 36.73,30.15
VCCBAT on Top Layer: 26.91,41.35 59.57,41.35 59.57,39.62 26.91,39.62
VCCBAT on Top Layer: 21.49,44.7 27.16,44.7 27.16,12.93 21.49,12.93
VCCBAT on Top Layer: 9.64,44.7 76.69,44.7 76.69,41.28 9.64,41.28
VCCBAT on Top Layer: 49.5,41.66 36.78,41.66 39.33,39.1 46.95,39.1
VCCBAT on Top Layer: 59.46,44.68 64.73,44.68 64.73,13.32 59.46,13.32
VCCBAT on Top Layer: 42.99,24.69 43.34,24.69 44.82,23.21 45.7,23.21 46.47,22.44 46.47,17.63 48.24,15.85 44.23,15.85 44.23,20.87 42.77,22.33 42.77,24.47
VCCBAT on Bottom Layer: 41.87,9.78 49.11,9.78 49.11,39.37 46.82,41.66 37.04,41.66 39.51,39.22 41.87,36.83
L_VS1 on Top Layer: 21.18,33.43 9.6,33.43 9.6,39.7 21.18,39.7
L_VS2 on Top Layer: 21.1,23.91 9.53,23.91 9.53,30.18 21.1,30.18
L_VS3 on Top Layer: 21.1,14.38 9.53,14.38 9.53,20.65 21.1,20.65
R_VS1 on Top Layer: 65.1,20.68 76.68,20.68 76.68,14.41 65.1,14.41
R_VS2 on Top Layer: 65.16,30.2 76.74,30.2 76.74,23.93 65.16,23.93
R_VS3 on Top Layer: 65.16,39.73 76.74,39.73 76.74,33.45 65.16,33.45
$1N6323 on Top Layer: 45.7,26.51 46.65,25.56 49.09,25.56 49.09,27.81 46.72,30.17 45.7,30.17
$1N6323 on Top Layer: 41.32,31.7 44.18,31.7 45.7,30.17 45.7,26.51 44.14,24.94 43.01,24.94 42.56,24.49 42.56,23.04 41.32,23.04
$1N6897 on Top Layer: 40.27,8.77 40.27,10.31 40.12,10.47 37.88,10.47 36.15,8.74 40.24,8.74

## Text on the board
Top Solder Mask Layer: GND
